# Altium schematic sheet ir_sender.SchDoc
size A4; DocumentNumber: 1; Revision: 0.1; SheetNumber: 1; SheetTotal: 1; HTL_Gruppe: 5; HTL_Klasse: 3AHEL; HTL_Zusaetzlicher_Titel: Empfänger und Anzeige; HTL_Schueler_Name: Hannah Purner, Philipp Doná; PageSetup: Record=PageOptions|CenterHorizontal=True|CenterVertical=True|PrintScale=1.00|XCorrection=1.00|YCorrection=1.00|PrintKind=0|BorderSize=5000000|LeftOffset=0|BottomOffset=0|Orientation=2|PaperLength=1000|PaperWidth=1000|Scale=100|PaperSource=7|PrintQuality=-4|MediaType=1|DitherType=10|PaperKind=A4|PrintScaleMode=1; HTL_Projektname: IR-DIstanz-Indikator; HTL_Dokumentenart: Schaltplan; HTL_Dokumentenstatus: Entwurf; SPICEModelCacheWMBXHUEL: <root> / <DocumentId>WMBXHUEL</DocumentId> / <CacheFrame Number="0"> / <Model Name="led_ir" Kind="MDL"> / <Text>*Typ INFRARED GaAs LED: Vf=1.2V Vr=5V If=40mA trr=3uS / *LED Pinout: 1=A, 2=K / .MODEL LED_IR D (IS=93.5P RS=84M N=2.63 BV=5 IBV=10U / + CJO=2.97P VJ=.75 M=.333 TT=4.32U)</Text> / </Model> / </CacheFrame> / </root>
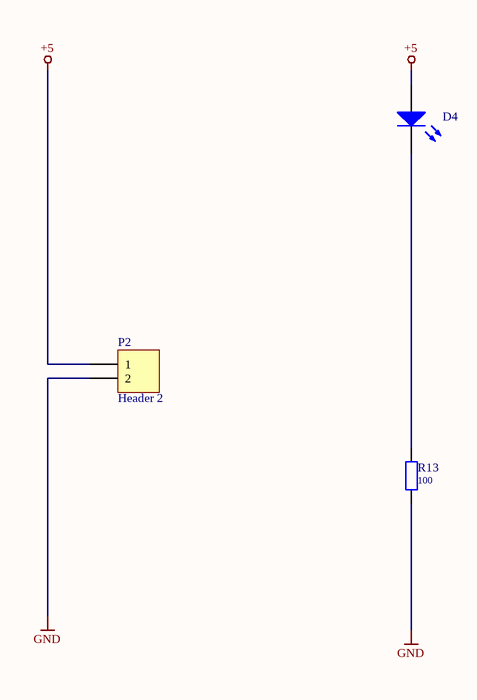
[diagram p0: ir_sender.SchDoc]

## Parts
D4  LED IR  [LED_5MM - clear]  (value not drawn)
P2  Header 2  [HDR1X2]
R13  100  [R_0207/RM4]

## Nets
+5: D4.A P2.1
GND: P2.2 R13.1
NetD4_K: D4.K R13.2

## Notes on the sheet
- Sachnummer / Dateiname:
- Name:
- Gruppe:
- Klasse:
- Elektronik &
- Technische Informatik
- Anichstraße 26 - 28
- HTBLVA
- Titel:
- Datum:
- Dokumentenart:
- Dokumentenstatus:
- A - 6020 Innsbruck
- Ver.:
- Blatt:
- Blätter:

## Library data of the parts
D4 = LED_IR: Infrared GaAs LED (Vf=1.2V, If=40mA); Usage: only permitted for non-commercial purposes at HTL I Innsbruck; SimulationModellSource: Miscellaneous Devices; Published: 21-Feb-2011; LatestRevisionDate: 01-Nov-2013
P2 = Header 2: Header, 2-Pin; LatestRevisionDate: 17-Jul-2002; LatestRevisionNote: Re-released for DXP Platform.; Publisher: Altium Limited
R13 = R: Resistor; Usage: only permitted for non-commercial purposes at HTL I Innsbruck; Published: 21-Feb-2011; LatestRevisionDate: 07-Sep-2019; Value: 100